# EAGLE design board (EAGLE 9.2.2)
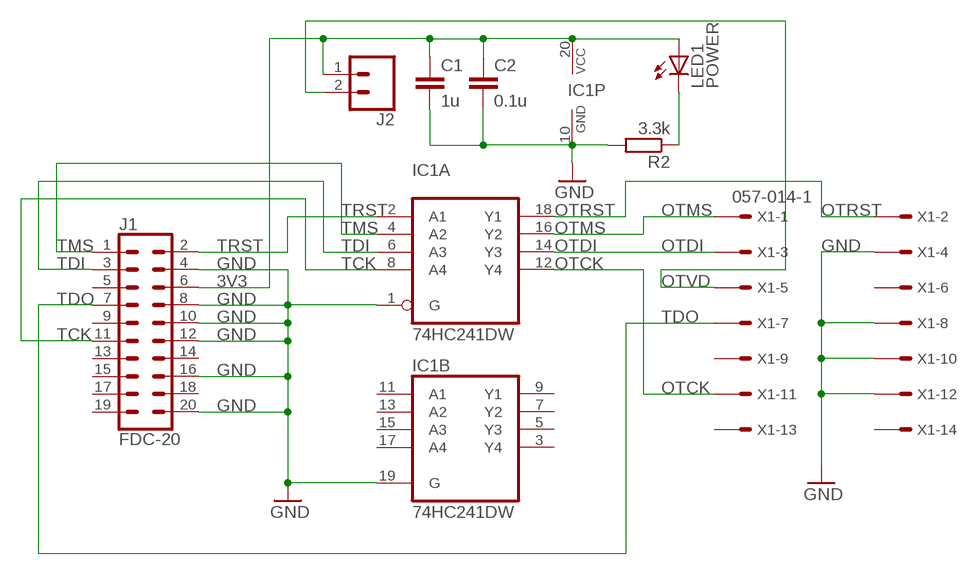
[diagram p0: schematic, sheet 1]

## Parts
C1  1u  C-EUC0805  [C0805]
C2  0.1u  C-EUC0805  [C0805]
IC1  74HC241DW  [SO20W]
J1  FDC-20  CONN_10X2NOSILK  [2X10_NOSILK]
J2  CONN_02  [1X02]
LED1  POWER  LEDCHIPLED_0805  [CHIPLED_0805]
R2  3.3k  R-EU_R0805  [R0805]
X1  057-014-1  [057-014-1]

## Nets
3V3: C1.1 C2.1 IC1.20(P:VCC) J1.6 J2.1 LED1.A
GND: C1.2 C2.2 IC1.1(A:G) IC1.10(P:GND) IC1.19(B:G) J1.4 J1.8 J1.10 J1.12 J1.16 J1.20 R2.2 X1.4 X1.8 X1.10 X1.12
N$1: LED1.C R2.1
OTCK: IC1.12(A:Y4) X1.11
OTDI: IC1.14(A:Y3) X1.3
OTMS: IC1.16(A:Y2) X1.1
OTRST: IC1.18(A:Y1) X1.2
OTVD: J2.2 X1.5
TCK: IC1.8(A:A4) J1.11
TDI: IC1.6(A:A3) J1.3
TDO: J1.7 X1.7
TMS: IC1.4(A:A2) J1.1
TRST: IC1.2(A:A1) J1.2
Unconnected: IC1.3(B:Y4) IC1.5(B:Y3) IC1.7(B:Y2) IC1.9(B:Y1) IC1.11(B:A1) IC1.13(B:A2) IC1.15(B:A3) IC1.17(B:A4) J1.5 J1.9 J1.13 J1.14 J1.15 J1.17 J1.18 J1.19 X1.6 X1.9 X1.13 X1.14

## Library data of the parts
C1 C2 = rcl:C-EU: CAPACITOR, European symbol; SPICEPREFIX: C
IC1 = 74xx-eu:74*241: Octal BUFFER and LINE DRIVER, 3-state
J1 = my_xds110:CONN_10X2: Multi connection point. Often used as Generic Header-pin footprint for 0.1 inch spaced/style header connections On any of the 0.1 inch spaced packages, you can populate with these: Break Away Headers - Straight <https://www.sparkfun.com/products/116> (PRT-00116) Break Away Male Headers - Right Angle <https://www.sparkfun.com/products/553> (PRT-00553) Female Headers <https://www.sparkfun.com/products/115> (PRT-00115) Break Away Headers - Machine Pin <https://www.sparkfun.com/products/117> (PRT-00117) Break Away Female Headers - Swiss Machine Pin <https://www.sparkfun.com/products/743> (PRT-00743) Special note about the "SPECIAL" package: This was SPECIALLY designed to be used with our Graphic LCD Backpack. Be sure you want to use this! It is not only staggered on each line of header holes, but IT IS ALSO offset of the center point of the top and bottom lines by 5 mil. This causes the headers to lock into place on the "standard" footprint on the LCD screen. The extra squares on the tdocu layer are there simply to reference other pins (if you were to actually populate a longer header than ten long - this is what we do with the backpacks).
J2 = SparkFun-Connectors:CONN_02: Multi connection point. Often used as Generic Header-pin footprint for 0.1 inch spaced/style header connections On any of the 0.1 inch spaced packages, you can populate with these: Break Away Headers - Straight <https://www.sparkfun.com/products/116> (PRT-00116) Break Away Male Headers - Right Angle <https://www.sparkfun.com/products/553> (PRT-00553) Female Headers <https://www.sparkfun.com/products/115> (PRT-00115) Break Away Headers - Machine Pin <https://www.sparkfun.com/products/117> (PRT-00117) Break Away Female Headers - Swiss Machine Pin <https://www.sparkfun.com/products/743> (PRT-00743) For SCREWTERMINALS and SPRING TERMINALS visit here: Screw Terimnals on SparkFun.com <https://www.sparkfun.com/search/results?term=Screw+Terminals> (5mm/3.5mm/2.54mm spacing) This device is also useful as a general connection point to wire up your design to another part of your project. Our various solder wires solder well into these plated through hole pads. Hook-Up Wire - Assortment (Stranded, 22 AWG) <https://www.sparkfun.com/products/11375> (PRT-11375) Hook-Up Wire - Assortment (Solid Core, 22 AWG) <https://www.sparkfun.com/products/11367> (PRT-11367) View the entire wire category on our website here <https://www.sparkfun.com/categories/141> Special notes: Molex polarized connector foot print use with: PRT-08233 with associated crimp pins and housings. 2.54_SCREWTERM for use with PRT-10571. 3.5mm Screw Terminal footprints for PRT-08084 5mm Screw Terminal footprints for use with PRT-08432
LED1 = led:LED: LED OSRAM: - CHIPLED LG R971, LG N971, LY N971, LG Q971, LY Q971, LO R971, LY R971 LH N974, LH R974 LS Q976, LO Q976, LY Q976 LO Q996 - Hyper CHIPLED LW Q18S LB Q993, LB Q99A, LB R99A - SideLED LS A670, LO A670, LY A670, LG A670, LP A670 LB A673, LV A673, LT A673, LW A673 LH A674 LY A675 LS A676, LA A676, LO A676, LY A676, LW A676 LS A679, LY A679, LG A679 - Hyper Micro SIDELED® LS Y876, LA Y876, LO Y876, LY Y876 LT Y87S - SmartLED LW L88C, LW L88S LB L89C, LB L89S, LG L890 LS L89K, LO L89K, LY L89K LS L896, LA L896, LO L896, LY L896 - TOPLED LS T670, LO T670, LY T670, LG T670, LP T670 LSG T670, LSP T670, LSY T670, LOP T670, LYG T670 LG T671, LOG T671, LSG T671 LB T673, LV T673, LT T673, LW T673 LH T674 LS T676, LA T676, LO T676, LY T676, LB T676, LH T676, LSB T676, LW T676 LB T67C, LV T67C, LT T67C, LS T67K, LO T67K, LY T67K, LW E67C LS E67B, LA E67B, LO E67B, LY E67B, LB E67C, LV E67C, LT E67C LW T67C LS T679, LY T679, LG T679 LS T770, LO T770, LY T770, LG T770, LP T770 LB T773, LV T773, LT T773, LW T773 LH T774 LS E675, LA E675, LY E675, LS T675 LS T776, LA T776, LO T776, LY T776, LB T776 LHGB T686 LT T68C, LB T68C - Hyper Mini TOPLED® LB M676 - Mini TOPLED Santana® LG M470 LS M47K, LO M47K, LY M47K Source: http://www.osram.convergy.de LUXEON: - LUMILED® LXK2-PW12-R00, LXK2-PW12-S00, LXK2-PW14-U00, LXK2-PW14-V00 LXK2-PM12-R00, LXK2-PM12-S00, LXK2-PM14-U00 LXK2-PE12-Q00, LXK2-PE12-R00, LXK2-PE12-S00, LXK2-PE14-T00, LXK2-PE14-U00 LXK2-PB12-K00, LXK2-PB12-L00, LXK2-PB12-M00, LXK2-PB14-N00, LXK2-PB14-P00, LXK2-PB14-Q00 LXK2-PR12-L00, LXK2-PR12-M00, LXK2-PR14-Q00, LXK2-PR14-R00 LXK2-PD12-Q00, LXK2-PD12-R00, LXK2-PD12-S00 LXK2-PH12-R00, LXK2-PH12-S00 LXK2-PL12-P00, LXK2-PL12-Q00, LXK2-PL12-R00 Source: www.luxeon.com KINGBRIGHT: KA-3528ASYC Source: www.kingbright.com
R2 = rcl:R-EU_: RESISTOR, European symbol; SPICEPREFIX: R
X1 = con-panduit:057-014-: CONNECTOR 10-pin series 057 contact pc board low profile headers; OC_FARNELL: unknown; OC_NEWARK: unknown

## Net classes
0 default: width 0.3 mm, drill 0.4 mm, clearance 0.3 mm

## Board
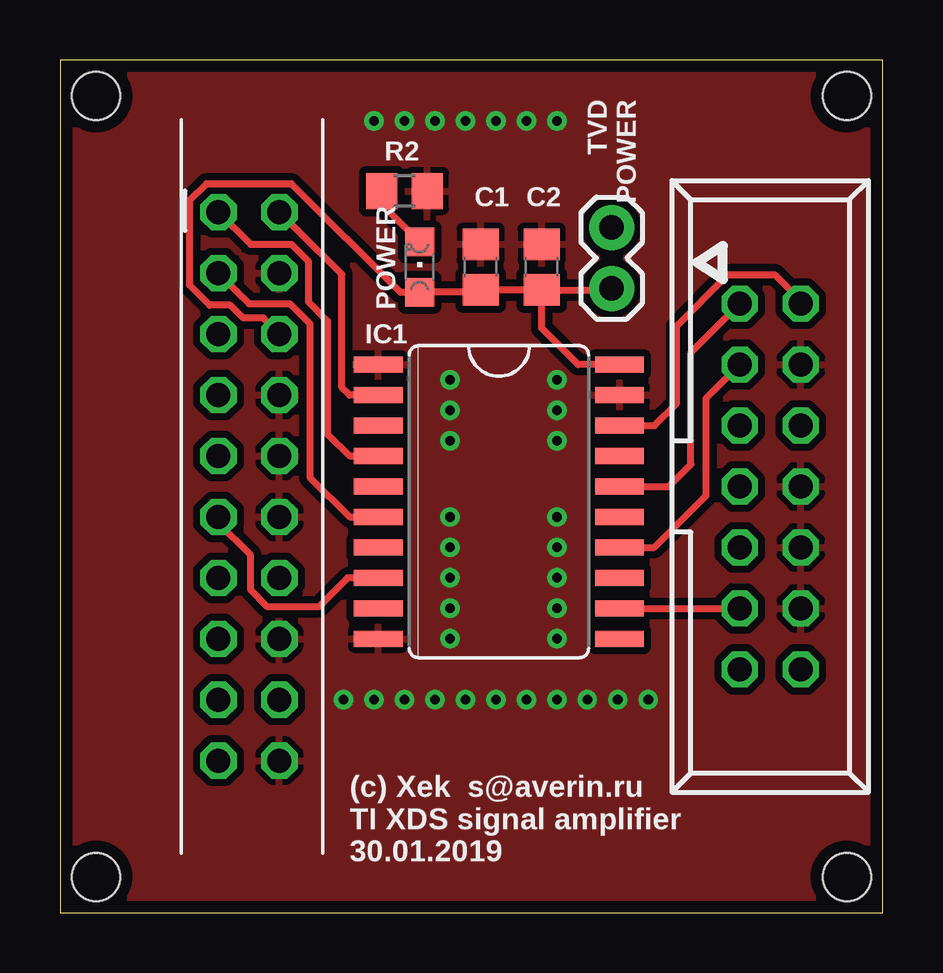
[diagram p1: board, top side]
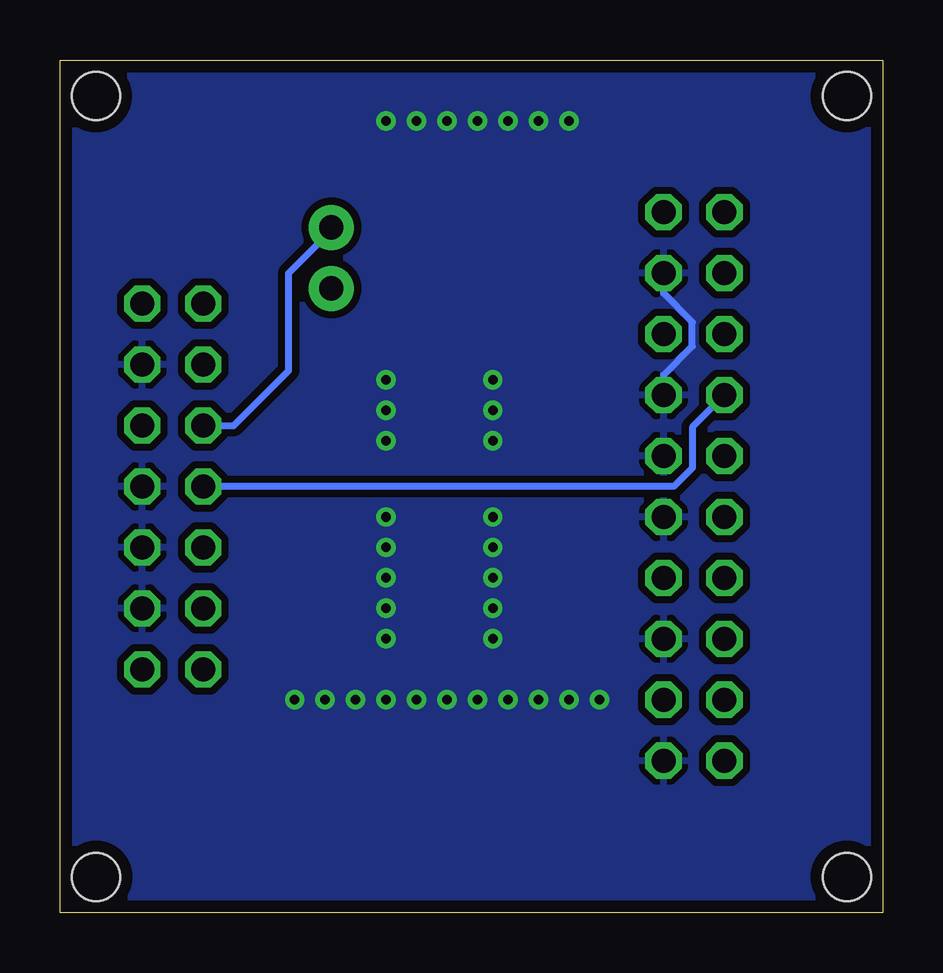
[diagram p2: board, bottom side, seen from below]

Size 34.29 x 35.56 mm. Coordinates in mm from the lower left corner, seen from the top.
Outline: 0,0 34.29,0 34.29,35.56 0,35.56 0,0
Copper layers (1*16): Top 0.035mm / dielectric 1.5mm / Bottom 0.035mm
Design rules "default *": minimum track width 6mil, minimum drill 0.35mm, track to track 0.3mm, track to pad 0.3mm, pad to pad 0.3mm, via to via 0.3mm, smd to smd 0.3mm, copper to edge 0.5mm, drill to drill 6mil, minimum pad ring 10mil, minimum via ring 8mil, stop-mask expansion 4mil, vias tented up to drill 0.8mm, thermal gap 10mil
Holes 2 mm at 1.5,1.5 1.5,34.06 32.79,34.06 32.79,1.5

### Footprints (pad centres in the part's own frame; a part is rotated, then mirrored left to right if it is on the bottom)
C0805 = smd 1.3 x 1.5: 1 -0.95,0; 2 0.95,0
SO20W = smd 0.66 x 2.032: 1 -5.715,-5.029; 2 -4.445,-5.029; 3 -3.175,-5.029; 4 -1.905,-5.029; 5 -0.635,-5.029; 6 0.635,-5.029; 7 1.905,-5.029; 8 3.175,-5.029; 9 4.445,-5.029; 10 5.715,-5.029; 11 5.715,5.029; 12 4.445,5.029; 13 3.175,5.029; 14 1.905,5.029; 15 0.635,5.029; 16 -0.635,5.029; 17 -1.905,5.029; 18 -3.175,5.029; 19 -4.445,5.029; 20 -5.715,5.029
2X10_NOSILK = drill 1 octagon: 1 0,0; 2 0,2.54; 3 2.54,0; 4 2.54,2.54; 5 5.08,0; 6 5.08,2.54; 7 7.62,0; 8 7.62,2.54; 9 10.16,0; 10 10.16,2.54; 11 12.7,0; 12 12.7,2.54; 13 15.24,0; 14 15.24,2.54; 15 17.78,0; 16 17.78,2.54; 17 20.32,0; 18 20.32,2.54; 19 22.86,0; 20 22.86,2.54
1X02 = drill 1.016 pad 1.88: 1 0,0; 2 2.54,0
CHIPLED_0805 = smd 1.2 x 1.2: A 0,-1.05; C 0,1.05
R0805 = smd 1.3 x 1.5: 1 -0.95,0; 2 0.95,0
057-014-1 = drill 1 octagon: 1 -7.62,-1.27; 2 -7.62,1.27; 3 -5.08,-1.27; 4 -5.08,1.27; 5 -2.54,-1.27; 6 -2.54,1.27; 7 0,-1.27; 8 0,1.27; 9 2.54,-1.27; 10 2.54,1.27; 11 5.08,-1.27; 12 5.08,1.27; 13 7.62,-1.27; 14 7.62,1.27

### Placement (x,y rotation side)
C1  17.53,26.92 90 top
C2  20.07,26.92 90 top
IC1  18.29,17.14 270 top
J1  6.6,29.21 270 top
J2  22.99,26.04 90 top
LED1  14.99,26.92 0 top
R2  14.35,30.1 0 top
X1  29.59,17.78 270 top

### Tracks (layer width: path | path; a pad name or v marks a point on that pad's centre or on a via)
3V3
  Top 0.3: J1.6 8.47,24.8 7.64,24.8 7.1,25.33 6.24,25.33 5.4,26.17 5.4,29.71 6.11,30.41 9.64,30.41 14.18,25.87 LED1.A 17.43,25.87 C1.1 C2.1 | C2.1 20.77,25.97 | 20.39,25.97 C2.1 | IC1.20 21.59,22.86 20.07,24.38 C2.1 | C2.1 22.93,25.97 J2.1
GND  (via drill 0.4)
  Bottom 0.3: J1.8 9.14,22.43 7.94,23.63 7.94,24.63 9.14,25.83 J1.4
  other vias: 13.08,33.02 14.35,33.02 15.62,33.02 16.89,33.02 18.16,33.02 19.43,33.02 20.7,33.02 11.81,8.89 13.08,8.89 14.35,8.89 15.62,8.89 16.89,8.89 18.16,8.89 19.43,8.89 20.7,8.89 21.97,8.89 23.24,8.89 24.51,8.89 16.26,22.23 20.7,22.23 16.26,20.95 20.7,20.95 16.26,19.68 20.7,19.68 16.26,16.51 20.7,16.51 16.26,15.24 20.7,15.24 16.26,13.97 20.7,13.97 16.26,12.7 20.7,12.7 16.26,11.43 20.7,11.43
  pour Bottom: 0,0 0,35.56 34.29,35.56 34.29,0
  pour Top: 0,0 0,35.56 34.29,35.56 34.29,0
N$1
  Top 0.3: R2.1 13.4,29.56 LED1.C
OTCK
  Top 0.3: IC1.12 X1.11
OTDI
  Top 0.3: IC1.14 24.77,15.24 26.92,17.4 26.92,21.46 X1.3
OTMS
  Top 0.3: X1.1 26.29,23.37 26.29,18.7 25.37,17.78 IC1.16
OTRST
  Top 0.3: IC1.18 24.77,20.32 25.69,21.24 25.69,24.47 27.82,26.6 29.78,26.6 30.86,25.52 X1.2
OTVD
  Bottom 0.3: X1.5 27.05,20.32 24.77,22.61 24.77,26.67 22.99,28.45 J2.2
TCK
  Top 0.3: IC1.8 11.99,13.97 10.79,12.77 8.64,12.77 7.94,13.47 7.94,14.92 6.6,16.26 J1.11
TDI
  Top 0.3: J1.3 7.34,25.93 7.35,25.93 7.88,25.4 9.58,25.4 10.41,24.56 10.41,18.16 12.06,16.51 IC1.6
TDO
  Bottom 0.3: J1.7 7.94,20.25 7.94,18.55 8.71,17.78 X1.7
TMS
  Top 0.3: J1.1 7.94,27.87 9.64,27.87 10.35,27.17 10.35,25.48 11.14,24.68 11.14,19.97 12.06,19.05 IC1.4
TRST
  Top 0.3: J1.2 9.88,28.47 9.89,28.47 11.74,26.62 11.74,21.91 12.06,21.59 IC1.2

### Text on the board
tPlace: TVD / POWER | (c) Xek s@averin.ru / TI XDS signal amplifier / 30.01.2019
tNames: POWER